# Altium schematic sheet Sheet4.SchDoc
size A; SheetNumber: 4; SheetTotal: 6
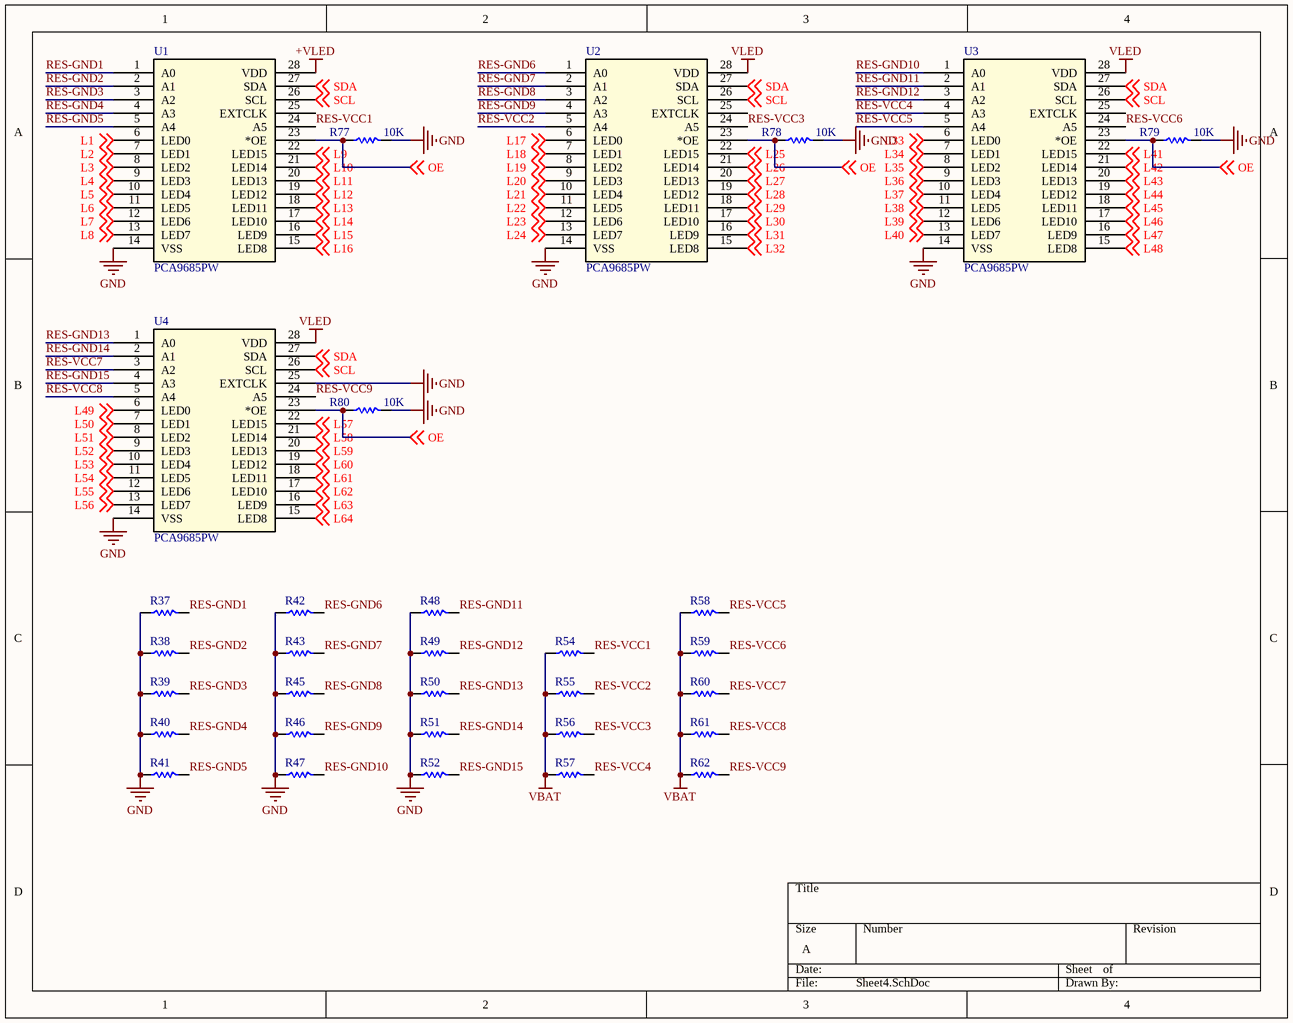
[diagram p0: Sheet4.SchDoc]

## Parts
R37  10K  [R 0805]  (value not drawn)
R38  10K  [R 0805]  (value not drawn)
R39  10K  [R 0805]  (value not drawn)
R40  10K  [R 0805]  (value not drawn)
R41  10K  [R 0805]  (value not drawn)
R42  10K  [R 0805]  (value not drawn)
R43  10K  [R 0805]  (value not drawn)
R45  10K  [R 0805]  (value not drawn)
R46  10K  [R 0805]  (value not drawn)
R47  10K  [R 0805]  (value not drawn)
R48  10K  [R 0805]  (value not drawn)
R49  10K  [R 0805]  (value not drawn)
R50  10K  [R 0805]  (value not drawn)
R51  10K  [R 0805]  (value not drawn)
R52  10K  [R 0805]  (value not drawn)
R54  10K  [R 0805]  (value not drawn)
R55  10K  [R 0805]  (value not drawn)
R56  10K  [R 0805]  (value not drawn)
R57  10K  [R 0805]  (value not drawn)
R58  10K  [R 0805]  (value not drawn)
R59  10K  [R 0805]  (value not drawn)
R60  10K  [R 0805]  (value not drawn)
R61  10K  [R 0805]  (value not drawn)
R62  10K  [R 0805]  (value not drawn)
R77  10K  [R 0805]
R78  10K  [R 0805]
R79  10K  [R 0805]
R80  10K  [R 0805]
U1  PCA9685PW  [SOT361-1_NXP]
U2  PCA9685PW  [SOT361-1_NXP]
U3  PCA9685PW  [SOT361-1_NXP]
U4  PCA9685PW  [SOT361-1_NXP]

## Nets
+VLED: U1.28(VDD)
GND: R37.1 R38.1 R39.1 R40.1 R41.1 R42.1 R43.1 R45.1 R46.1 R47.1 R48.1 R49.1 R50.1 R51.1 R52.1 R77.2 R78.2 R79.2 R80.2 U1.14(VSS) U2.14(VSS) U3.14(VSS) U4.14(VSS) U4.25(EXTCLK)
VBAT: R54.1 R55.1 R56.1 R57.1 R58.1 R59.1 R60.1 R61.1 R62.1
VLED: U2.28(VDD) U3.28(VDD) U4.28(VDD)
L1: U1.6(LED0) ; off-sheet L1
L2: U1.7(LED1) ; off-sheet L2
L3: U1.8(LED2) ; off-sheet L3
L4: U1.9(LED3) ; off-sheet L4
L5: U1.10(LED4) ; off-sheet L5
L6: U1.11(LED5) ; off-sheet L6
L7: U1.12(LED6) ; off-sheet L7
L8: U1.13(LED7) ; off-sheet L8
L9: U1.22(LED15) ; off-sheet L9
L10: U1.21(LED14) ; off-sheet L10
L11: U1.20(LED13) ; off-sheet L11
L12: U1.19(LED12) ; off-sheet L12
L13: U1.18(LED11) ; off-sheet L13
L14: U1.17(LED10) ; off-sheet L14
L15: U1.16(LED9) ; off-sheet L15
L16: U1.15(LED8) ; off-sheet L16
L17: U2.6(LED0) ; off-sheet L17
L18: U2.7(LED1) ; off-sheet L18
L19: U2.8(LED2) ; off-sheet L19
L20: U2.9(LED3) ; off-sheet L20
L21: U2.10(LED4) ; off-sheet L21
L22: U2.11(LED5) ; off-sheet L22
L23: U2.12(LED6) ; off-sheet L23
L24: U2.13(LED7) ; off-sheet L24
L25: U2.22(LED15) ; off-sheet L25
L26: U2.21(LED14) ; off-sheet L26
L27: U2.20(LED13) ; off-sheet L27
L28: U2.19(LED12) ; off-sheet L28
L29: U2.18(LED11) ; off-sheet L29
L30: U2.17(LED10) ; off-sheet L30
L31: U2.16(LED9) ; off-sheet L31
L32: U2.15(LED8) ; off-sheet L32
L33: U3.6(LED0) ; off-sheet L33
L34: U3.7(LED1) ; off-sheet L34
L35: U3.8(LED2) ; off-sheet L35
L36: U3.9(LED3) ; off-sheet L36
L37: U3.10(LED4) ; off-sheet L37
L38: U3.11(LED5) ; off-sheet L38
L39: U3.12(LED6) ; off-sheet L39
L40: U3.13(LED7) ; off-sheet L40
L41: U3.22(LED15) ; off-sheet L41
L42: U3.21(LED14) ; off-sheet L42
L43: U3.20(LED13) ; off-sheet L43
L44: U3.19(LED12) ; off-sheet L44
L45: U3.18(LED11) ; off-sheet L45
L46: U3.17(LED10) ; off-sheet L46
L47: U3.16(LED9) ; off-sheet L47
L48: U3.15(LED8) ; off-sheet L48
L49: U4.6(LED0) ; off-sheet L49
L50: U4.7(LED1) ; off-sheet L50
L51: U4.8(LED2) ; off-sheet L51
L52: U4.9(LED3) ; off-sheet L52
L53: U4.10(LED4) ; off-sheet L53
L54: U4.11(LED5) ; off-sheet L54
L55: U4.12(LED6) ; off-sheet L55
L56: U4.13(LED7) ; off-sheet L56
L57: U4.22(LED15) ; off-sheet L57
L58: U4.21(LED14) ; off-sheet L58
L59: U4.20(LED13) ; off-sheet L59
L60: U4.19(LED12) ; off-sheet L60
L61: U4.18(LED11) ; off-sheet L61
L62: U4.17(LED10) ; off-sheet L62
L63: U4.16(LED9) ; off-sheet L63
L64: U4.15(LED8) ; off-sheet L64
OE: R77.1 R78.1 R79.1 R80.1 U1.23(*OE) U2.23(*OE) U3.23(*OE) U4.23(*OE) ; off-sheet OE
RES-GND1: R37.2 U1.1(A0)
RES-GND2: R38.2 U1.2(A1)
RES-GND3: R39.2 U1.3(A2)
RES-GND4: R40.2 U1.4(A3)
RES-GND5: R41.2 U1.5(A4)
RES-GND6: R42.2 U2.1(A0)
RES-GND7: R43.2 U2.2(A1)
RES-GND8: R45.2 U2.3(A2)
RES-GND9: R46.2 U2.4(A3)
RES-GND10: R47.2 U3.1(A0)
RES-GND11: R48.2 U3.2(A1)
RES-GND12: R49.2 U3.3(A2)
RES-GND13: R50.2 U4.1(A0)
RES-GND14: R51.2 U4.2(A1)
RES-GND15: R52.2 U4.4(A3)
RES-VCC1: R54.2 U1.24(A5)
RES-VCC2: R55.2 U2.5(A4)
RES-VCC3: R56.2 U2.24(A5)
RES-VCC4: R57.2 U3.4(A3)
RES-VCC5: R58.2 U3.5(A4)
RES-VCC6: R59.2 U3.24(A5)
RES-VCC7: R60.2 U4.3(A2)
RES-VCC8: R61.2 U4.5(A4)
RES-VCC9: R62.2 U4.24(A5)
SCL: U1.26(SCL) U2.26(SCL) U3.26(SCL) U4.26(SCL) ; off-sheet SCL
SDA: U1.27(SDA) U2.27(SDA) U3.27(SDA) U4.27(SDA) ; off-sheet SDA

Not connected (* = marked no-connect by the designer): U1 25(EXTCLK); U2 25(EXTCLK); U3 25(EXTCLK)

## Library data of the parts
R37-R43 R45-R52 R54-R62 R77-R80 = R: Chip resistor; 版权归属: 源创客; BOM名称: Chip resistor; 学习资源: www.ooocke.com
U1-U4 = PCA9685PW: No Description Available; Vendor: NXP; Built_By: EMA_UL_Team; SourceLibrary: NXP_2011-11-10; Manufacturer_Part_Number: PCA9685PW; Copyright: Copyright (C) 2018 Accelerated Designs. All rights reserved; RefDes: RefDes; Type: DEV